# Altium schematic sheet ESP-MGMT.SchDoc: ESP-MGMT
size B; SheetNumber: 4; SheetTotal: 9
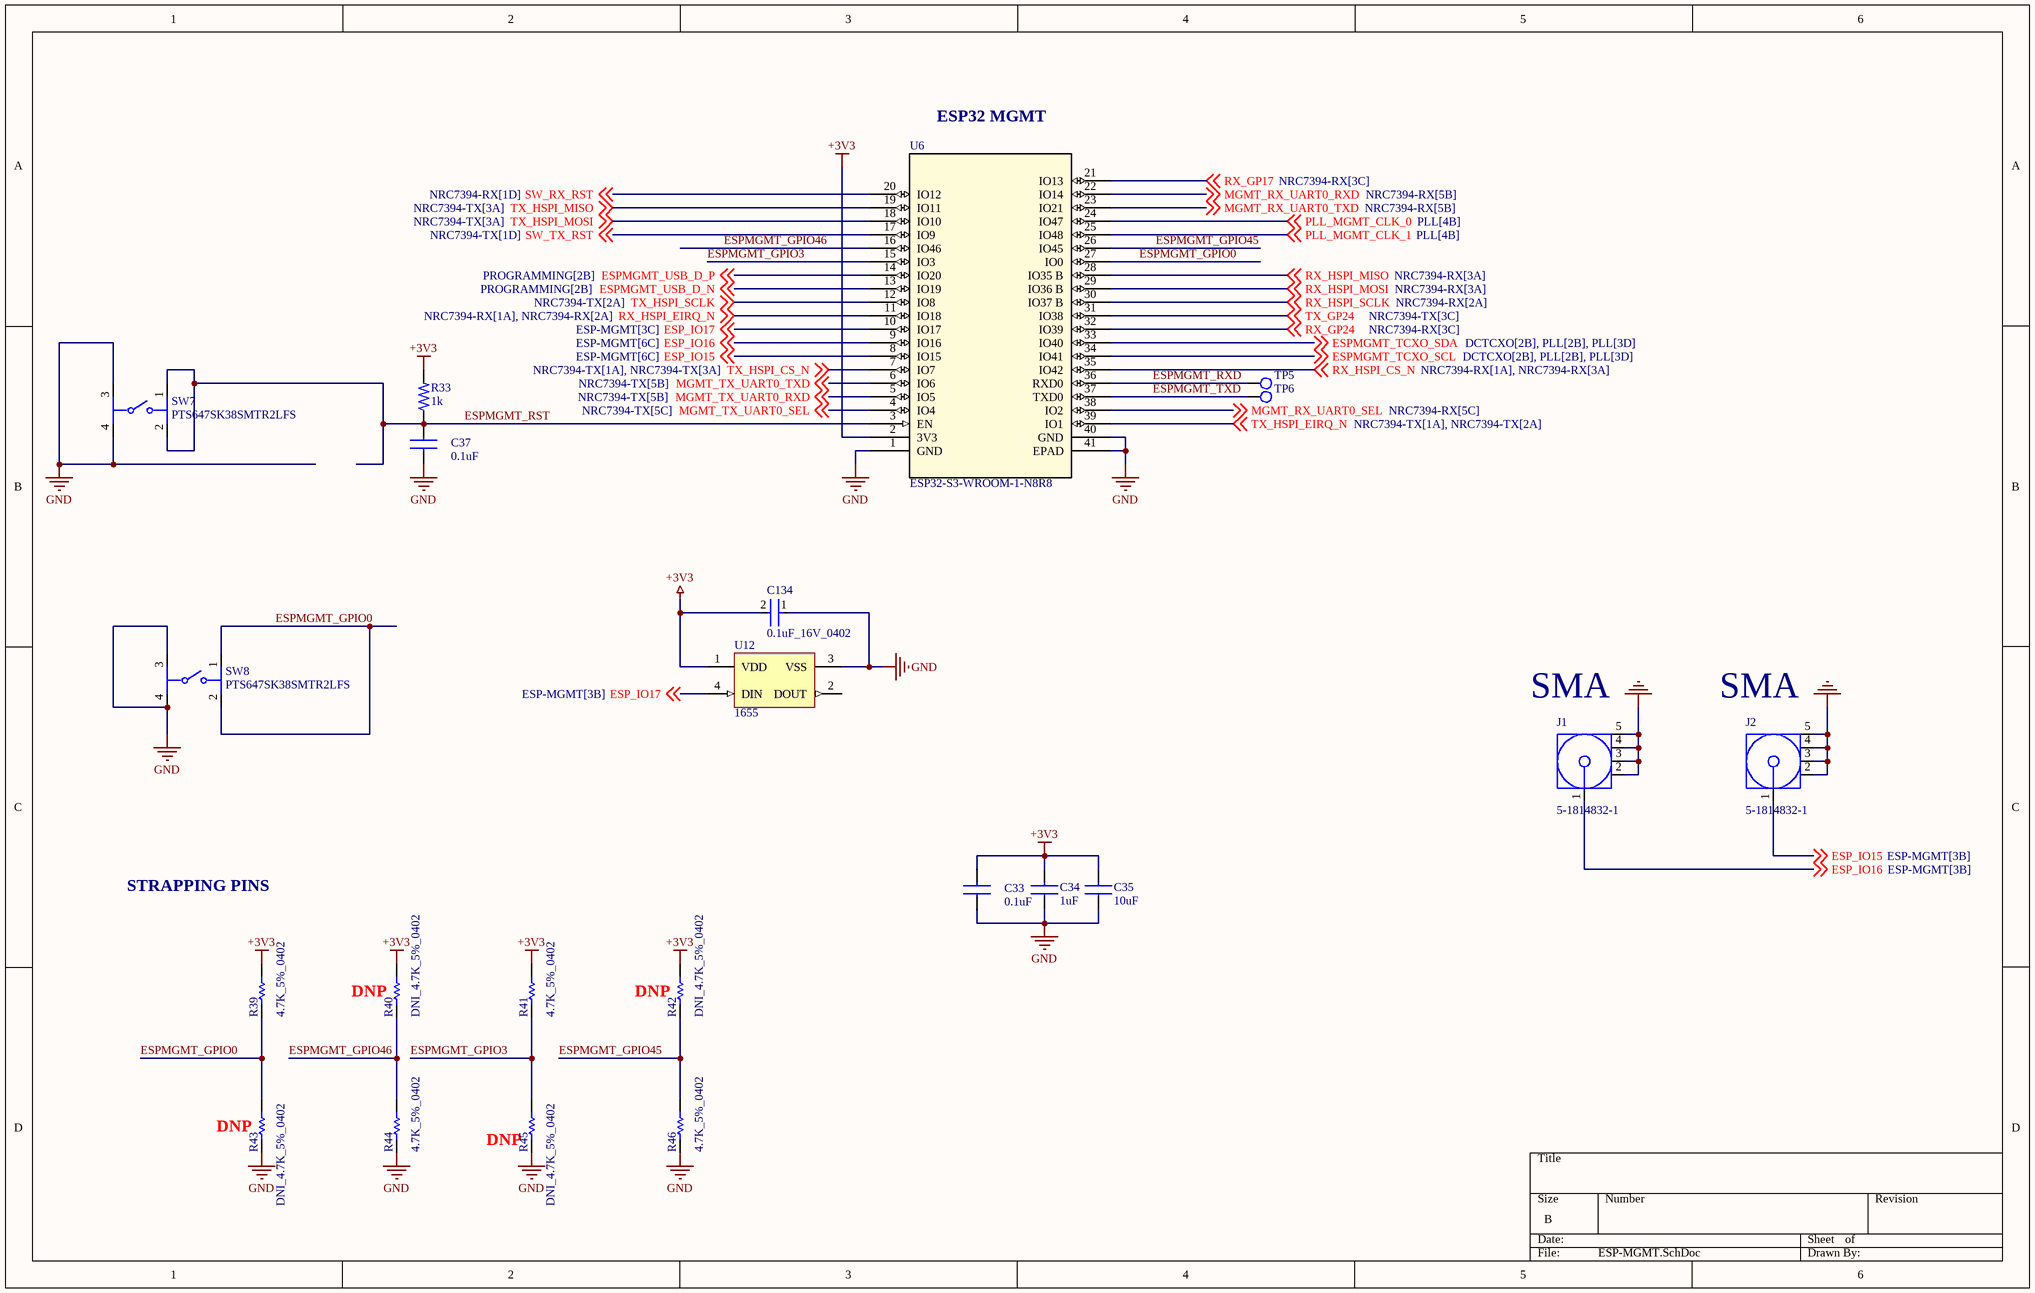
[diagram p0: ESP-MGMT.SchDoc]

## Parts
C33  0.1uF  [CAP_0402]
C34  1uF  [CAP_0402]
C35  10uF  [CAP_0402]
C37  0.1uF  [CAP_0402]
C134  0.1uF_16V_0402  [FP-C0402-BB-MFG]
J1  5-1814832-1  [TECO-5-1814832-1_V]
J2  5-1814832-1  [TECO-5-1814832-1_V]
R33  1k  [RES_0402]
R39  4.7K_5%_0402  [RESC1005X40X25LL05T05]
R40  DNI_4.7K_5%_0402  [RESC1005X40X25LL05T05]  (no BOM)
R41  4.7K_5%_0402  [RESC1005X40X25LL05T05]
R42  DNI_4.7K_5%_0402  [RESC1005X40X25LL05T05]  (no BOM)
R43  DNI_4.7K_5%_0402  [RESC1005X40X25LL05T05]  (no BOM)
R44  4.7K_5%_0402  [RESC1005X40X25LL05T05]
R45  DNI_4.7K_5%_0402  [RESC1005X40X25LL05T05]  (no BOM)
R46  4.7K_5%_0402  [RESC1005X40X25LL05T05]
SW7  PTS647SK38SMTR2LFS  [FP-PTS647SK38SMTR2LFS-MFG]
SW8  PTS647SK38SMTR2LFS  [FP-PTS647SK38SMTR2LFS-MFG]
TP5  Test Point 1MM  [TP_PAD-1MM]  (value not drawn)  (no BOM)
TP6  Test Point 1MM  [TP_PAD-1MM]  (value not drawn)  (no BOM)
U6  ESP32-S3-WROOM-1-N8R8  [ESP32-S3-WROOM-1_EXP]
U12  1655  [ADA-RGB-1655_V]

## Nets
+3V3: C33.2 C34.2 C35.2 C134.2 R33.2 R39.2 R40.2 R41.2 R42.2 U6.2(3V3) U12.1(VDD)
GND: C33.1 C34.1 C35.1 C37.1 C134.1 J1.2 J1.3 J1.4 J1.5 J2.2 J2.3 J2.4 J2.5 R43.1 R44.1 R45.1 R46.1 SW7.3 SW7.4 SW8.3 SW8.4 U6.1(GND) U6.40(GND) U6.41(EPAD) U12.3(VSS)
ESP_IO15: J2.1 U6.8(IO15) ; off-sheet ESP_IO15
ESP_IO16: J1.1 U6.9(IO16) ; off-sheet ESP_IO16
ESP_IO17: U6.10(IO17) U12.4(DIN) ; off-sheet ESP_IO17
ESPMGMT_GPIO0: R39.1 R43.2 SW8.1 SW8.2 U6.27(IO0)
ESPMGMT_GPIO3: R41.1 R45.2 U6.15(IO3)
ESPMGMT_GPIO45: R42.1 R46.2 U6.26(IO45)
ESPMGMT_GPIO46: R40.1 R44.2 U6.16(IO46)
ESPMGMT_RST: C37.2 R33.1 SW7.1 SW7.2 U6.3(EN)
ESPMGMT_RXD: TP5.1 U6.36(RXD0)
ESPMGMT_TCXO_SCL: U6.34(IO41) ; off-sheet ESPMGMT_TCXO_SCL
ESPMGMT_TCXO_SDA: U6.33(IO40) ; off-sheet ESPMGMT_TCXO_SDA
ESPMGMT_TXD: TP6.1 U6.37(TXD0)
ESPMGMT_USB_D_N: U6.13(IO19) ; off-sheet ESPMGMT_USB_D_N
ESPMGMT_USB_D_P: U6.14(IO20) ; off-sheet ESPMGMT_USB_D_P
MGMT_RX_UART0_RXD: U6.22(IO14) ; off-sheet MGMT_RX_UART0_RXD
MGMT_RX_UART0_SEL: U6.38(IO2) ; off-sheet MGMT_RX_UART0_SEL
MGMT_RX_UART0_TXD: U6.23(IO21) ; off-sheet MGMT_RX_UART0_TXD
MGMT_TX_UART0_RXD: U6.5(IO5) ; off-sheet MGMT_TX_UART0_RXD
MGMT_TX_UART0_SEL: U6.4(IO4) ; off-sheet MGMT_TX_UART0_SEL
MGMT_TX_UART0_TXD: U6.6(IO6) ; off-sheet MGMT_TX_UART0_TXD
PLL_MGMT_CLK_0: U6.24(IO47) ; off-sheet PLL_MGMT_CLK_0
PLL_MGMT_CLK_1: U6.25(IO48) ; off-sheet PLL_MGMT_CLK_1
RX_GP17: U6.21(IO13) ; off-sheet RX_GP17
RX_GP24: U6.32(IO39) ; off-sheet RX_GP24
RX_HSPI_CS_N: U6.35(IO42) ; off-sheet RX_HSPI_CS_N
RX_HSPI_EIRQ_N: U6.11(IO18) ; off-sheet RX_HSPI_EIRQ_N
RX_HSPI_MISO: U6.28(IO35_B) ; off-sheet RX_HSPI_MISO
RX_HSPI_MOSI: U6.29(IO36_B) ; off-sheet RX_HSPI_MOSI
RX_HSPI_SCLK: U6.30(IO37_B) ; off-sheet RX_HSPI_SCLK
SW_RX_RST: U6.20(IO12) ; off-sheet SW_RX_RST
SW_TX_RST: U6.17(IO9) ; off-sheet SW_TX_RST
TX_GP24: U6.31(IO38) ; off-sheet TX_GP24
TX_HSPI_CS_N: U6.7(IO7) ; off-sheet TX_HSPI_CS_N
TX_HSPI_EIRQ_N: U6.39(IO1) ; off-sheet TX_HSPI_EIRQ_N
TX_HSPI_MISO: U6.19(IO11) ; off-sheet TX_HSPI_MISO
TX_HSPI_MOSI: U6.18(IO10) ; off-sheet TX_HSPI_MOSI
TX_HSPI_SCLK: U6.12(IO8) ; off-sheet TX_HSPI_SCLK

Not connected (* = marked no-connect by the designer): U12 2(DOUT)

## Notes on the sheet
- ESP32 MGMT
- (near J1) SMA
- (near J2) SMA
- STRAPPING PINS
- (near R40) DNP
- (near R42) DNP
- (near R43) DNP
- (near R45) DNP

## Library data of the parts
C33 C37 = CAP_GCM155R71C104KA55J: Cap Ceramic 0.1uF 16V X7R 10% SMD 0402 125C Paper T/R; Manufacturer: Murata; Capacitance: 100nF; Supplier 1: Digi-Key; Manufacturer Part Number: GCM155R71C104KA55J; RoHS: Yes; Category: Ceramic Capacitors; Stock 1: 10738061; Pricing 1: 1=0.10000, 10=0.03500, 50=0.01920, 100=0.01560, 500=0.01116, 1000=0.00877, 2500=0.00798, 5000=0.00734 (USD); Mount: Surface Mount; Case/Package: 0402; Case Code (Imperial): 0402; Case Code (Metric): 1005; Min Operating Temperature: -55°C; Max Operating Temperature: 125°C; Tolerance: 10%; Voltage Rating: 16V; Voltage Rating (DC): 16V; Packaging: Tape and Reel; Package Quantity: 1; Dielectric: X7R; Termination: SMD/SMT; Series: GCM; Construction: Flat; Length: 1mm; Width: 0.5mm; Height: 0.5mm; Thickness: 0.022inch; Depth: 0.5mm; Ratings: AEC-Q200; Radiation Hardening: No; Lead Free: Lead Free; ComponentLink1URL: https://datasheet.ciiva.com/11618/product-11618848.pdf?src-supplier=Avnet; ComponentLink1Description: https://datasheet.ciiva.com/11618/product-11618848.pdf?src-supplier=Avnet; ComponentLink2URL: https://datasheet.ciiva.com/16440/gcm155r71c104ka55j-16440393.pdf?src-supplier=Future+Electronics; ComponentLink2Description: https://datasheet.ciiva.com/16440/gcm155r71c104ka55j-16440393.pdf?src-supplier=Future+Electronics; ComponentLink3URL: https://datasheet.ciiva.com/29542/product-29542474.pdf?src-supplier=Digi-Key; ComponentLink3Description: https://datasheet.ciiva.com/29542/product-29542474.pdf?src-supplier=Digi-Key; ComponentLink4URL: https://datasheet.ciiva.com/29542/product-29542475.pdf?src-supplier=Digi-Key; ComponentLink4Description: https://datasheet.ciiva.com/29542/product-29542475.pdf?src-supplier=Digi-Key; Supplier Part Number 1: 490-7998-1-ND
C34 = CAP_CL05A105KA5NQNC: Cap Ceramic 1uF 25V X5R 10% SMD 0402 85°C Cardboard T/R; Manufacturer: Samsung; Supplier 1: Digi-Key; Manufacturer Part Number: CL05A105KA5NQNC; RoHS: Yes; Category: Ceramic Capacitors; Pricing 1: 1=0.21000, 10=0.14900, 50=0.08460, 100=0.07000, 500=0.04910, 1000=0.04065, 2500=0.03784, 5000=0.03462 (USD); Mount: Surface Mount; Case/Package: 0402; Case Code (Metric): 1005; Case Code (Imperial): 0402; Material: Ceramic; Min Operating Temperature: -55°C; Max Operating Temperature: 85°C; Tolerance: 10%; Capacitance: 1uF; Voltage Rating: 25V; Packaging: Tape and Reel; Package Quantity: 10000; Dielectric: X5R; Series: CL; Construction: Flat; Length: 1mm; Width: 0.02inch; Height: 0.5mm; Depth: 0.5mm; Thickness: 0.022inch; Radiation Hardening: No; Lead Free: Lead Free; RoHS Compliant: Yes; ComponentLink1URL: https://datasheet.ciiva.com/3777/cl05a105ka5nqnc-3777709.pdf?src-supplier=Arrow+Electronics; ComponentLink1Description: https://datasheet.ciiva.com/3777/cl05a105ka5nqnc-3777709.pdf?src-supplier=Arrow+Electronics; ComponentLink2URL: https://datasheet.ciiva.com/25720/cl05a105ka5nqnc-25720771.pdf?src-supplier=Digi-Key; ComponentLink2Description: https://datasheet.ciiva.com/25720/cl05a105ka5nqnc-25720771.pdf?src-supplier=Digi-Key; ComponentLink3URL: https://datasheet.ciiva.com/29198/459147-da-01-en-vs-kondensator-0402-29198339.pdf?src-supplier=Conrad; ComponentLink3Description: https://datasheet.ciiva.com/29198/459147-da-01-en-vs-kondensator-0402-29198339.pdf?src-supplier=Conrad; Supplier Part Number 1: 1276-1445-6-ND
C35 = CAP_CL05A106MQ5NUNC: Cap Ceramic 10uF 6.3V X5R 20% SMD 0402 85°C Paper T/R; Manufacturer: Samsung; Supplier 1: Digi-Key; Manufacturer Part Number: CL05A106MQ5NUNC; RoHS: Yes; Category: Ceramic Capacitors; Stock 1: 3345553; Pricing 1: 1=0.27000, 10=0.18400, 50=0.11020, 100=0.09300, 500=0.06362, 1000=0.05629, 2500=0.05384, 5000=0.04894 (USD); Mount: Surface Mount; Case/Package: 0402; Case Code (Metric): 1005; Case Code (Imperial): 0402; Min Operating Temperature: -55°C; Max Operating Temperature: 85°C; Tolerance: 20%; Capacitance: 10uF; Dielectric: X5R; Packaging: Tape and Reel; Package Quantity: 1; Voltage Rating: 6.3V; Series: CL; Construction: Flat; Length: 1mm; Width: 0.02inch; Height: 0.5mm; Thickness: 0.028inch; Depth: 0.5mm; Radiation Hardening: No; ComponentLink1URL: https://datasheet.ciiva.com/16437/cl05a106mq5nunc-16437356.pdf?src-supplier=Future+Electronics; ComponentLink1Description: https://datasheet.ciiva.com/16437/cl05a106mq5nunc-16437356.pdf?src-supplier=Future+Electronics; ComponentLink2URL: https://datasheet.ciiva.com/26877/getdatasheetpartid-355289-26877841.pdf?src-supplier=Verical; ComponentLink2Description: https://datasheet.ciiva.com/26877/getdatasheetpartid-355289-26877841.pdf?src-supplier=Verical; Supplier Part Number 1: 1276-1451-1-ND
C134 = CMP-2008-02094-2: CAP CER 0.1UF 16V 20% X7R 0402; Manufacturer: Kemet; Manufacturer Part Number: C0402C104M4RACTU; Temperature Coefficient: 15%; Material: Ceramic; Capacitance: 0.10 μF; Tolerance: 0.2; Value: 0.10 μF; Temperature Range High: +125°C; Device Class L3: Ceramic Capacitors; Category: Cap; RoHS: TRUE; ComponentLink2URL: https://content.kemet.com/datasheets/KEM_C1002_X7R_SMD.pdf; Temperature: -55°C to +125°C; Octopart: https://octopart.com/c0402c104m4ractu-kemet-10476575; Automotive: No; Height: 0.55mm; ComponentLink2Description: Datasheet; Device Class L2: Capacitors; Voltage Rating: 16 V; Device Class L1: Passive Components; Temperature Characteristic: X7R; Lead Free: Yes; Digikey Description: CAP CER 0.1UF 16V 20% X7R 0402; Mouser Description: Multilayer Ceramic Capacitors MLCC - SMD/SMT 16volts 0.1uF X7R 20%; Temperature Range Low: -55°C; Ipc Land Pattern Name: CAPC10050X50; Package: C0402-BB
J1 J2 = CMP-2000-05415-1: SMA Connector, Pitch 5.08 mm, 1 Position, Height 9.5 mm, Tail Length 4 mm, -65 to 165 degC, RoHS, Bulk; Manufacturer: TE Connectivity; Connector Mounting: PCBMount; Connector Body Style: StraightJack; Impedance: 50ohm; Coaxial Termination: Solder; SVHC: NoSVHC(15-Jun-2015); Frequency Max: 3GHz; Product Range: ZDCSeries; Connector Type: SMACoaxial; Datasheet Version: Rev. B1, 03/2011; Package Reference: 5-1814832-1; Package Description: SMA Connector, Pitch 5.08 mm, 1 Position, Height 9.5 mm, Tail Length 4 mm; Contact Plating: GoldPlatedContacts; Coaxial Cable Types: -; Contact Material: BerylliumCopper; Manufacturer URL: http://www.te.com/; Datasheet URL: http://www.onlinecomponents.com/productFiles/mf-AMP/eng_cd_1814832_a.pdf
R33 = RES_RC0402JR-071KL: Res General Purpose Thick Film 0402 1K Ohm 5% 1/16W ±100ppm/°C Molded SMD Paper T/R; Manufacturer: Yageo; Resistance: 1kR; Power Rating: 62.5mW; Voltage Rating: 50V; Max Power Dissipation: 63mW; Supplier 1: Digi-Key; Manufacturer Part Number: RC0402JR-071KL; RoHS: Yes; Category: Chip SMD Resistors; Stock 1: 1442131; Pricing 1: 1=0.10000, 10=0.01300, 100=0.00540, 1000=0.00244, 2500=0.00212, 5000=0.00175 (USD); Case/Package: 0402; Case Code (Imperial): 0402; Case Code (Metric): 1005; Size Code: 0402; Min Operating Temperature: -55°C; Max Operating Temperature: 155°C; Tolerance: 5%; Packaging: Tape and Reel; Package Quantity: 1; Termination: SMD/SMT; Resistor Type: Thick Film; Number of Terminations: 2; Temperature Coefficient: 100ppm/°C; Features: Moisture Resistant; Series: RC; Resistance Tolerance: 5%; Construction: Rectangular; Length: 0.039inch; Width: 0.02inch; Height: 0.016inch; Depth: 0.5mm; REACH SVHC: No SVHC; Military Standard: Not; Lead Free: Lead Free; RoHS Compliant: Yes; ComponentLink1URL: https://datasheet.ciiva.com/2452/pyu-r-int-thick-7-2452755.pdf?src-supplier=Digi-Key; ComponentLink1Description: https://datasheet.ciiva.com/2452/pyu-r-int-thick-7-2452755.pdf?src-supplier=Digi-Key; ComponentLink2URL: https://datasheet.ciiva.com/2452/pyu-r-int-thick-7-2452756.pdf?src-supplier=Digi-Key; ComponentLink2Description: https://datasheet.ciiva.com/2452/pyu-r-int-thick-7-2452756.pdf?src-supplier=Digi-Key; ComponentLink3URL: https://datasheet.ciiva.com/2452/pyu-r-int-thick-7-2452757.pdf?src-supplier=Digi-Key; ComponentLink3Description: https://datasheet.ciiva.com/2452/pyu-r-int-thick-7-2452757.pdf?src-supplier=Digi-Key; ComponentLink4URL: https://datasheet.ciiva.com/17081/pyu-rc0402-51-rohs-l-6-r-17081438.pdf?src-supplier=Future+Electronics; ComponentLink4Description: https://datasheet.ciiva.com/17081/pyu-rc0402-51-rohs-l-6-r-17081438.pdf?src-supplier=Future+Electronics; ComponentLink5URL: https://datasheet.ciiva.com/7850/1018594-7850170.pdf?src-supplier=Element14; ComponentLink5Description: https://datasheet.ciiva.com/7850/1018594-7850170.pdf?src-supplier=Element14; ComponentLink6URL: https://datasheet.ciiva.com/7850/1018594-7850171.pdf?src-supplier=Element14; ComponentLink6Description: https://datasheet.ciiva.com/7850/1018594-7850171.pdf?src-supplier=Element14; ComponentLink7URL: https://datasheet.ciiva.com/7983/1018594-7983558.pdf?src-supplier=Element14; ComponentLink7Description: https://datasheet.ciiva.com/7983/1018594-7983558.pdf?src-supplier=Element14; Supplier Part Number 1: 311-1.0KJRCT-ND
R39-R46 = CMP-1011-00090-2: Part Number: CRCW04024K70JNTD; Manufacturer: Vishay Dale
SW7 SW8 = CMP-10040-000033-1: TACT 4.5 X 4.5, 3.8 MM H, 2.5N,; Switch Function: Off-Mom; Switch Travel: 0.25mm; Actuator Type: Standard; Illumination Type: Non-Illuminated; Mechanical Life: 100000Cycles; Ratings: IP40; Operating Force: 250gf; Throw Configuration: SPST; Max Operating Temperature: 70°C; Min Operating Temperature: -20°C; Termination: Gull Wing; Mount: Surface Mount; Packaging: Tape and Reel
TP5 TP6 = TP_PAD-1MM
U6 = ESP32-S3-WROOM-1-N8R8: No Description Available; Mfr_Name: Espressif Systems; Type: Transceiver module; RefDes: RefDes
U12 = CMP-2000-05026-1: Intelligent Control LED Integrated Light Source, 3.5 to 5.3 V, -25 to 80 degC, 4-Pin SMD, RoHS, Tape and Reel; Manufacturer: Adafruit-Industries-LLC; Number of LEDs: 10; Configuration: Discrete; Utilized LED: WS2812(5050); Datasheet URL: http://datasheet.octopart.com/ADA1655-Adafruit-Industries-datasheet-32028139.pdf; Series: Neopixel; Interface: -; Package Description: 4-Pin Surface Mount Device, Body 5 x 5 mm; Color: Red,Green,Blue(RGB); Category: Optoelectronics; Controller Type: -; Package Reference: 1655; Manufacturer URL: https://www.adafruit.com/; Mounting Type: SurfaceMount; Datasheet Version: May-13; Size / Dimension: 5.00mmLx5.00mmW; Family: Addressable,Specialty